# EasyEDA schematic SCH.json
TITLE: Sheet_1; REV: 1.0; Date: 2023-12-19; Sheet: 1/1; Drawn By: xbst_; Company: Your Company
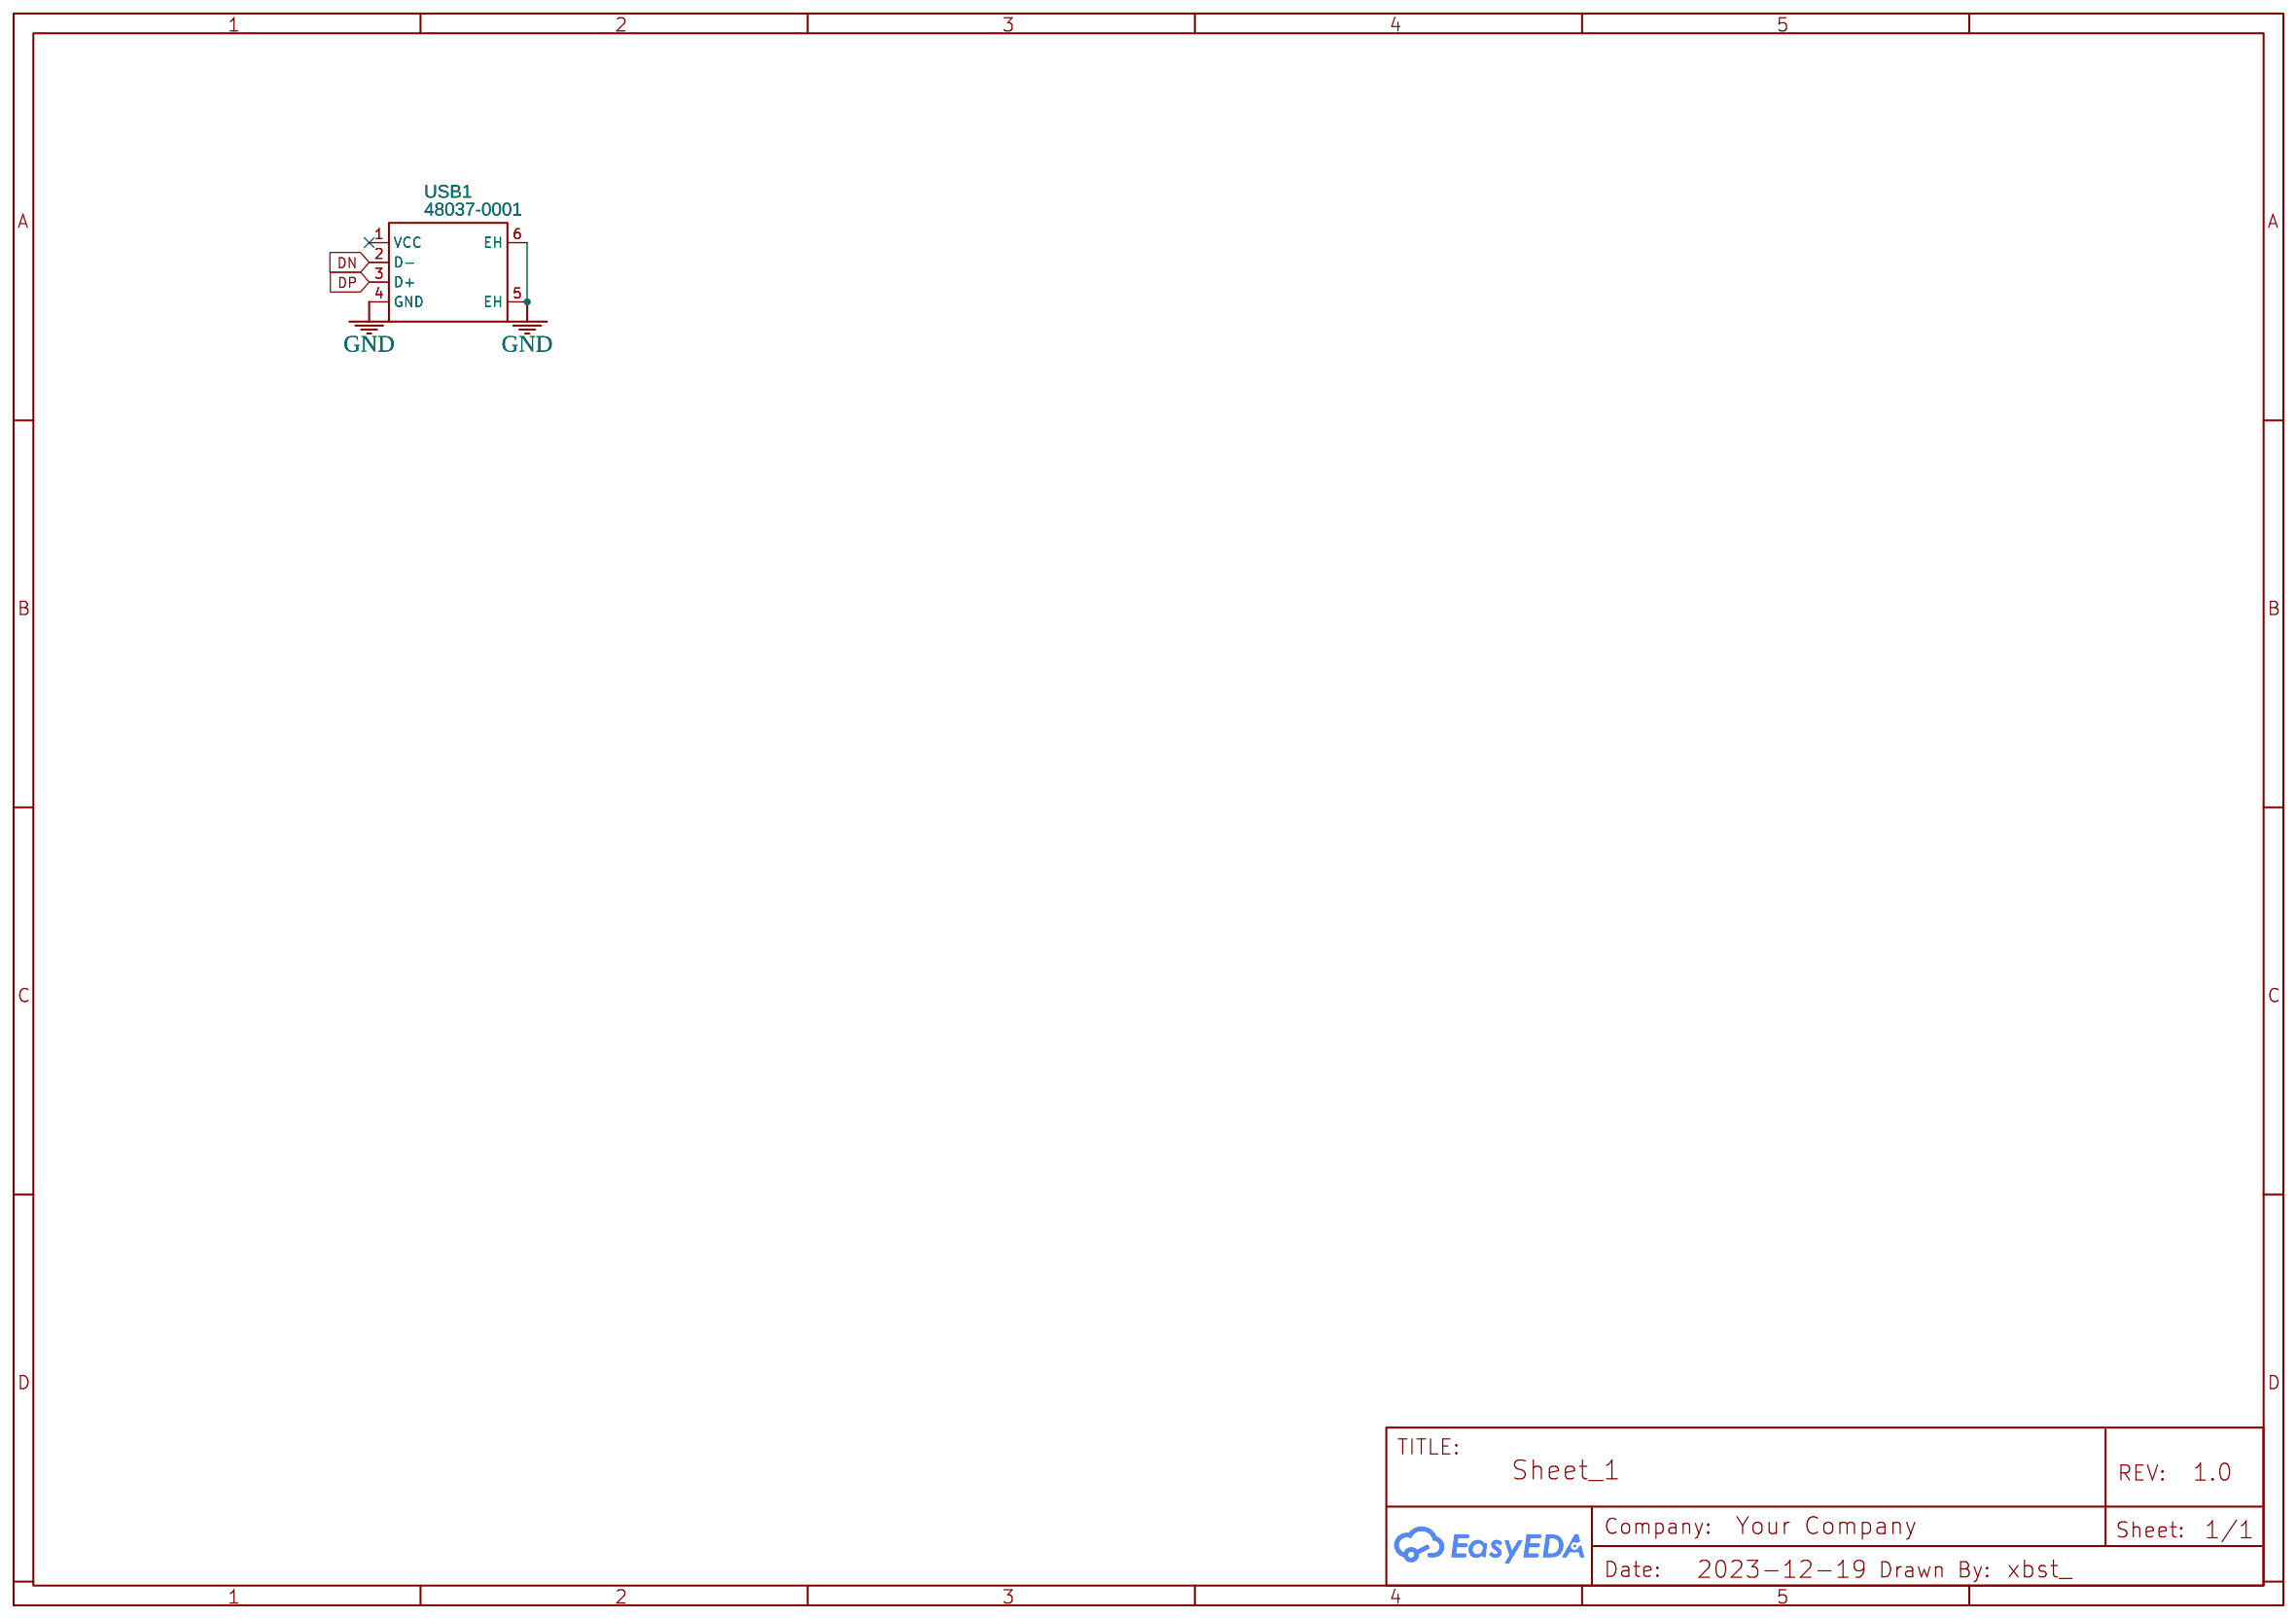
[diagram p0: schematic sheet]

## Parts
USB1  48037-0001  [USB-A-TH_48037-0001]

## Library data of the parts
USB1 = 48037-0001: Contributor: LCSC; Supplier: LCSC; Supplier Part: C136455; Manufacturer: MOLEX; Manufacturer Part: 480370001; JLCPCB Part Class: Extended Part; link: https://lcsc.com/eda_search?q=C136455&%26type=1&ref=editor

## Nets
GND: USB1.4(GND) USB1.5(EH) USB1.6(EH)
DN: USB1.2(D-)
DP: USB1.3(D+)

Not connected (* = marked no-connect by the designer): USB1 1(VCC)*
